# Altium project Timingcard_PROJECT.PrjPcb
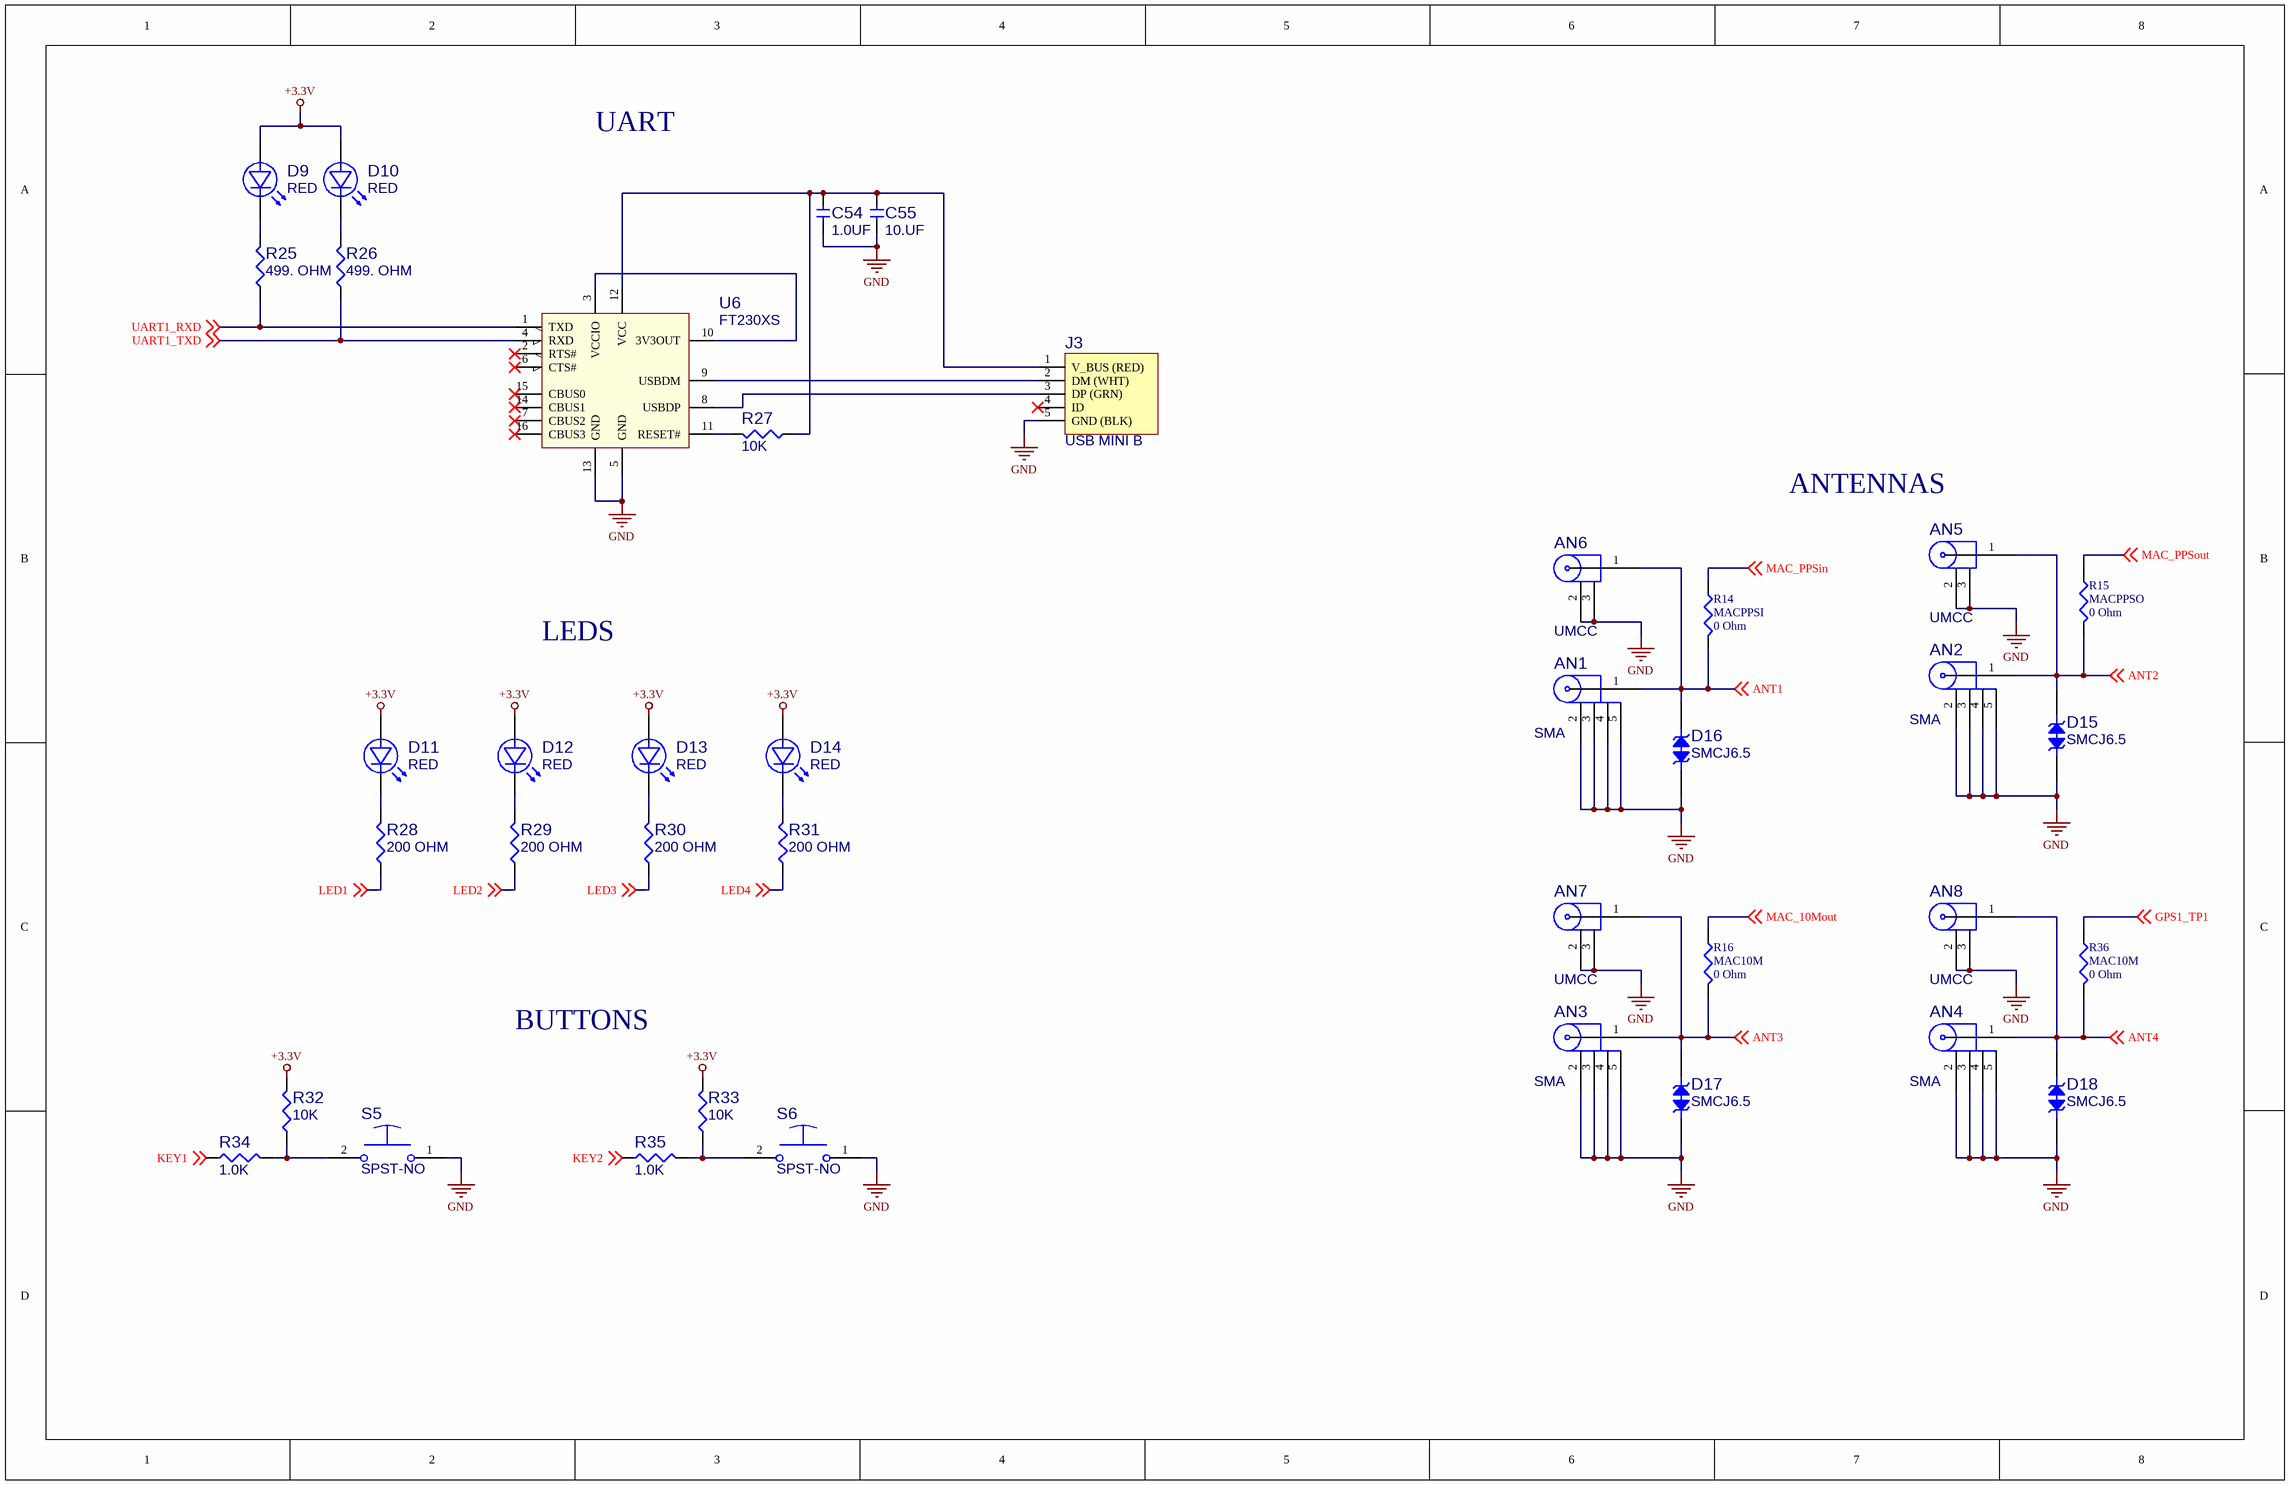
[diagram p0: UART.SchDoc]
2 sheets, 67 parts. Net scope: global (net labels, ports and power ports of the same name join across sheets).
Board file: Timingcard_PCB.PcbDoc
Sheets:
  UART.SchDoc
  MAC.SchDoc

## Sheet UART.SchDoc: Grandmaster UART, Antennas, and RTC
size Tabloid; Author: N Smith; Revision: A; SheetNumber: 3; SheetTotal: 6; Customer: 01910

### Parts
AN1  value SMA  [AMPHENOL-901-143-6RFX]  (hidden comment: RF-901-143-6FRX)
AN2  value SMA  [AMPHENOL-901-143-6RFX]  (hidden comment: RF-901-143-6FRX)
AN3  value SMA  [AMPHENOL-901-143-6RFX]  (hidden comment: RF-901-143-6FRX)
AN4  value SMA  [AMPHENOL-901-143-6RFX]  (hidden comment: RF-901-143-6FRX)
AN5  value UMCC  [U.FL UMCC JACK]  (hidden comment: 1909763-1)
AN6  value UMCC  [U.FL UMCC JACK]  (hidden comment: 1909763-1)
AN7  value UMCC  [U.FL UMCC JACK]  (hidden comment: 1909763-1)
AN8  value UMCC  [U.FL UMCC JACK]  (hidden comment: 1909763-1)
C54  value 1.0UF  [CAPC2012X14N]  (hidden comment: CAP_0805_1UF_25V)
C55  value 10.UF  [CAPC1608X10N]  (hidden comment: GRT188R61E106ME13D)
D9  RED  [DIOM1608X06N]
D10  RED  [DIOM1608X06N]
D11  RED  [DIOM1608X06N]
D12  RED  [DIOM1608X06N]
D13  RED  [DIOM1608X06N]
D14  RED  [DIOM1608X06N]
D15  value SMCJ6.5  [DIOM6959X26N]  (hidden comment: SMCJ6.5CA)
D16  value SMCJ6.5  [DIOM6959X26N]  (hidden comment: SMCJ6.5CA)
D17  value SMCJ6.5  [DIOM6959X26N]  (hidden comment: SMCJ6.5CA)
D18  value SMCJ6.5  [DIOM6959X26N]  (hidden comment: SMCJ6.5CA)
J3  value USB MINI B  [USB_1734035]  (hidden comment: USB_B_1734035)
R14  MACPPSI  value 0 Ohm  [J1-0603]
R15  MACPPSO  value 0 Ohm  [J1-0603]
R16  MAC10M  value 0 Ohm  [J1-0603]
R25  value 499. OHM  [RESC1005X04N]  (hidden comment: ERJ-2RKF4990X)
R26  value 499. OHM  [RESC1005X04N]  (hidden comment: ERJ-2RKF4990X)
R27  value 10K  [RESC1608X50N]  (hidden comment: ERJ-3EKF1002V)
R28  value 200 OHM  [RESC1608X50N]  (hidden comment: ERJ-3EKF2000V)
R29  value 200 OHM  [RESC1608X50N]  (hidden comment: ERJ-3EKF2000V)
R30  value 200 OHM  [RESC1608X50N]  (hidden comment: ERJ-3EKF2000V)
R31  value 200 OHM  [RESC1608X50N]  (hidden comment: ERJ-3EKF2000V)
R32  value 10K  [RESC1608X50N]  (hidden comment: ERJ-3EKF1002V)
R33  value 10K  [RESC1608X50N]  (hidden comment: ERJ-3EKF1002V)
R34  value 1.0K  [RESC1608X50N]  (hidden comment: ERJ-3EKF1001V)
R35  value 1.0K  [RESC1608X50N]  (hidden comment: ERJ-3EKF1001V)
R36  MAC10M  value 0 Ohm  [J1-0603]
S5  value SPST-NO  [OMRON-B3U-1000P]  (hidden comment: B3U-1000P)
S6  value SPST-NO  [OMRON-B3U-1000P]  (hidden comment: B3U-1000P)
U6  value FT230XS  [SOP64P600X170-16N]  (hidden comment: FT230XS-R)

### Nets
+3.3V: D9.2(A) D10.2(A) D11.2(A) D12.2(A) D13.2(A) D14.2(A) R32.2 R33.2
GND: AN1.2 AN1.3 AN1.4 AN1.5 AN2.2 AN2.3 AN2.4 AN2.5 AN3.2 AN3.3 AN3.4 AN3.5 AN4.2 AN4.3 AN4.4 AN4.5 AN5.2 AN5.3 AN6.2 AN6.3 AN7.2 AN7.3 AN8.2 AN8.3 C54.1 C55.1 D15.K D16.K D17.K D18.K J3.5(GND_(BLK)) S5.1 S6.1 U6.5(GND) U6.13(GND)
ANT1: AN1.1 AN6.1 D16.A R14.2 ; off-sheet ANT1
ANT2: AN2.1 AN5.1 D15.A R15.2 ; off-sheet ANT2
ANT3: AN3.1 AN7.1 D17.A R16.2 ; off-sheet ANT3
ANT4: AN4.1 AN8.1 D18.A R36.2 ; off-sheet ANT4
GPS1_TP1: R36.1 ; off-sheet GPS1_TP1
KEY1: R34.1 ; off-sheet KEY1
KEY2: R35.1 ; off-sheet KEY2
LED1: R28.1 ; off-sheet LED1
LED2: R29.1 ; off-sheet LED2
LED3: R30.1 ; off-sheet LED3
LED4: R31.1 ; off-sheet LED4
MAC_10Mout: R16.1 ; off-sheet MAC_10Mout
MAC_PPSin: R14.1 ; off-sheet MAC_PPSin
MAC_PPSout: R15.1 ; off-sheet MAC_PPSout
UART1_RXD: R25.1 U6.1(TXD) ; off-sheet UART1_RXD
UART1_TXD: R26.1 U6.4(RXD) ; off-sheet UART1_TXD
NetC54_2: C54.2 C55.2 J3.1(V_BUS_(RED)) R27.1 U6.12(VCC)
NetD9_1: D9.1(K) R25.2
NetD10_1: D10.1(K) R26.2
NetD11_1: D11.1(K) R28.2
NetD12_1: D12.1(K) R29.2
NetD13_1: D13.1(K) R30.2
NetD14_1: D14.1(K) R31.2
NetJ3_2: J3.2(DM_(WHT)) U6.9(USBDM)
NetJ3_3: J3.3(DP_(GRN)) U6.8(USBDP)
NetR27_2: R27.2 U6.11(RESET#)
NetR32_1: R32.1 R34.2 S5.2
NetR33_1: R33.1 R35.2 S6.2
NetU6_3: U6.3(VCCIO) U6.10(3V3OUT)

Not connected (* = marked no-connect by the designer): J3 4(ID)*; U6 2(RTS#)* 6(CTS#)* 7(CBUS2)* 14(CBUS1)* 15(CBUS0)* 16(CBUS3)*

### Notes on the sheet
- UART
- ANTENNAS
- LEDS
- BUTTONS

### Library data of the parts
AN1-AN4 = RF-901-143-6FRX: CONN, JACK, SMA, FEMALE, 50 OHM, R/A, GOLD, TH; MFG PART NUM: 901-143-6RFX; VALENTIUM PART NUM: <VALENTIUM>; MFG Name: AMPHENOL; MAXTEMP: 165C; MINTEMP: -65C; P2: 50 OHM; MODIFY DATE: 10/10/2013; CATEGORY: CONN, JACK; OTHER: GOLD; P1: FEMALE; P3: R/A; SIZE: 9.86MM HT; DESC: CONN, JACK, SMA, FEMALE, 50 OHM, R/A, GOLD, TH; Supplier 1: Digi-Key; Supplier Part Number 1: ARFX1232-ND
AN5-AN8 = UMCC: CONN, JACK, UMCC, MALE, 50 OHM, U.FL, GOLD, SMT; VALENTIUM PART NUM: <VALENTIUM>; MFG Name: TE; MAXTEMP: 90C; MINTEMP: -40C; P2: 50 OHM; P3: ST; MFG PART NUM: 1909763-1; MODIFY DATE: 10/10/2013; CATEGORY: CONN, JACK; OTHER: GOLD; P1: MALE; SIZE: 1.25MM HT; DESC: CONN, JACK, UMCC, MALE, 50 OHM, U.FL, GOLD, SMT; Supplier 1: Digi-Key; Supplier Part Number 1: A118077CT-ND
C54 = CAP_0805_1UF_25V: CAP, CER, 1.0UF, 25V, 10%, X5R, 0805; MFG PART NUM: 08053D105KAT2A; VALENTIUM PART NUM: <VALENTIUM>; MFG NAME: AVX; MAXTEMP: 85C; MINTEMP: -55C; MODIFY DATE: 10/23/2013; CATEGORY: CAP, CER; Date: 4/11/2006 3:37:28 PM; SHEETPART: *; P1: 10%; P2: 25V; P3: X5R; Size: 0805; Supplier 1: Digi-Key; Supplier Part Number 1: 478-1409-1-ND; DESC: CAP, CER, 1.0UF, 25V, 10%, X5R, 0805
C55 = CAP_0603_10UF_25V: CAP, CER, 10.UF, 25V, 20%, X5R, AEC-Q200, 0603; VALENTIUM PART NUM: <VALENTIUM>; MFG NAME: MURATA; MAXTEMP: 85C; MINTEMP: -55C; CATEGORY: CAP, CER; MFG PART NUM: GRT188R61E106ME13D; MODIFY DATE: 10/23/2013; Date: 7/25/2013; SHEETPART: *; P1: 20%; OTHER: AEC-Q200; P2: 25V; P3: X5R; Size: 0603; DESC: CAP, CER, 10.UF, 25V, 20%, X5R, AEC-Q200, 0603; Supplier 1: Digi-Key; Supplier Part Number 1: 490-12323-6-ND
D9-D14 = SMTLED_RED_0603_SML: LED, RED, SML-LX0603, 635NM, 2V, 20MA, 0603; MFG PART NUM: SML-LX0603IW-TR; VALENTIUM PART NUM: <VALENTIUM>; MFG NAME: LUMEX; MAXTEMP: 85C; MINTEMP: -25C; MODIFY DATE: 9/4/2013; CATEGORY: LED; OTHER: SML-LX0603; P1: 635NM; P2: 2V; P3: 20MA; SIZE: 0603; SHEETPART: *; DESC: LED, RED, SML-LX0603, 635NM, 2V, 20MA, 0603; Supplier 1: Digi-Key; Supplier Part Number 1: 67-1548-1-ND; VALUE: RED
D15-D18 = SMCJ6.5CA: DIO, TVS, SMCJ6.5, 6.5V, BIDIR, 1.5KW, SMC; VALENTIUM PART NUM: <VALENTIUM>; MFG NAME: LITTELFUSE; MAXTEMP: 150C; MINTEMP: -55C; OTHER: SMCJ; MFG PART NUM: SMCJ6.5CA; MODIFY DATE: 9/4/2013; CATEGORY: DIO, TVS; P1: 6.5V; P2: BIDIR; P3: 1.5KW; SIZE: SMC; SHEETPART: *; Supplier 1: Digi-Key; Supplier Part Number 1: SMCJ6.5CALFCT-ND; DESC: DIO, TVS, SMCJ6.5, 6.5V, BIDIR, 1.5KW, SMC
J3 = USB_B_1734035: CONN, REC, USB, R/A, MINI, TYPE B, 5 POS, SMT W/BRD GUIDE; MFG PART NUM: 1734035-2; VALENTIUM PART NUM: <VALENTIUM>; MFG NAME: TE CONNECTIVITY/AMP; MAXTEMP: C; P2: 5 POS; CATEGORY: CONN, REC; MODIFY DATE: 10/10/2013; MINTEMP: C; OTHER: USB; P1: R/A; P3: USB MINI B; SIZE: SMT; DESC: CONN, REC, USB, R/A, MINI, TYPE B, 5 POS, SMT W/BRD GUIDE; Supplier 1: Digi-Key; Supplier Part Number 1: A31727CT-ND
R14-R16 R36 = Res3: Resistor; Published: 8-Jun-2000; LatestRevisionDate: 29-May-2009; LatestRevisionNote: IPC-7351 Footprint Added.; PackageReference: J1-0603; Publisher: Altium Limited; PackageDescription: Chip Resistor
R25 R26 = RES_0402_499: RES, 499. OHM, 1%, 1/16W, TF, AEC-Q200, 0402; VELENTIUM PART NUM: <VELENTIUM>; MFG NAME: PANASONIC; MAXTEMP: 155C; MINTEMP: -55C; OTHER: 100PPM, AEC-Q200; SUB: GENERIC; ModifyDate: 7/25/2013; MFG PART NUM: ERJ-2RKF4990X; CATEGORY: RES; Date: 7/26/2013; P1: 1%; P3: TF; P2: 1/16W; SIZE: 0402; SHEETPART: *; DESC: RES, 499. OHM, 1%, 1/16W, TF, AEC-Q200, 0402; Supplier 1: Digi-Key; Supplier Part Number 1: P499LCT-ND
R27 R32 R33 = RES_0603_10K: RES, 10K, 1%, 1/10W, TF, 0603; VELENTIUM PART NUM: <VELENTIUM>; MFG NAME: PANASONIC; MAXTEMP: 125C; MINTEMP: -55C; OTHER: 100PPM; SUB: GENERIC; ModifyDate: 7/25/2013; MFG PART NUM: ERJ-3EKF1002V; CATEGORY: RES; Date: 7/26/2013; P1: 1%; P3: TF; P2: 1/10W; SIZE: 0603; Supplier 1: Digi-Key; Supplier Part Number 1: P10.0KHCT-ND; SHEETPART: *; DESC: RES, 10K, 1%, 1/10W, TF, 0603
R28-R31 = RES_0603_200: RES, 200 OHM, 1%, 1/10W, TF, 0603; VELENTIUM PART NUM: <VELENTIUM>; MFG NAME: PANASONIC; MAXTEMP: 125C; MINTEMP: -55C; OTHER: 100PPM; SUB: GENERIC; ModifyDate: 7/25/2013; MFG PART NUM: ERJ-3EKF2000V; CATEGORY: RES; Date: 7/26/2013; P1: 1%; P3: TF; P2: 1/10W; SIZE: 0603; SHEETPART: *; DESC: RES, 200 OHM, 1%, 1/10W, TF, 0603; Supplier 1: Digi-Key; Supplier Part Number 1: P200HCT-ND
R34 R35 = RES_0603_1.0K: RES, 1.0K, 1%, 1/10W, TF, 0603; VELENTIUM PART NUM: <VELENTIUM>; MFG NAME: PANASONIC; MAXTEMP: 125C; MINTEMP: -55C; OTHER: 100PPM; SUB: GENERIC; ModifyDate: 7/25/2013; MFG PART NUM: ERJ-3EKF1001V; CATEGORY: RES; Date: 7/26/2013; P1: 1%; P3: TF; P2: 1/10W; SIZE: 0603; Supplier 1: Digi-Key; Supplier Part Number 1: P1.00KHCT-ND; SHEETPART: *; DESC: RES, 1.0K, 1%, 1/10W, TF, 0603
S5 S6 = B3U-1000P: SW, SPST-NO, TACT, 12V, 50MA, 3X2.5MM SMT, B3U SERIES; VALENTIUM PART NUM: <VALENTIUM>; MFG NAME: OMRON; MAXTEMP: 70C; MINTEMP: -25C; MFG PART NUM: B3U-1000P; MODIFY DATE: 9/5/2013; CATEGORY: SW; OTHER: B3U SERIES; P1: 12V; P2: 50mA; P3: TACT; SIZE: 3X2.5MM; SHEETPART: *; DESC: SW, SPST-NO, TACT, 12V, 50MA, 3X2.5MM SMT, B3U SERIES; Supplier 1: Digi-Key; Supplier Part Number 1: SW1020CT-ND
U6 = FT230XS-R: IC, TCVR, FT230, USB TO UART, 5V, FTDI, 16SSOP; VELENTIUM PART NUM: <V PART NUM>; MAXTEMP: 85C; MINTEMP: -40C; MFG PART NUM: FT230XS-R; MFG NAME: FTDI; MODIFY DATE: 8/14/2013; CATEGORY: IC, TCVR; P1: USB TO UART; P2: 5V; P3: FTDI; SIZE: 20SSOP; SHEETPART: *; DESC: IC, TCVR, FT230, USB TO UART, 5V, FTDI, 16SSOP; Supplier 1: Digi-Key; Supplier Part Number 1: 768-1135-1-ND

## Sheet MAC.SchDoc: Grandmaster MAC & Clock Generation
size Tabloid; Author: N Smith; Revision: A; SheetNumber: 5; SheetTotal: 6; Customer: 01910
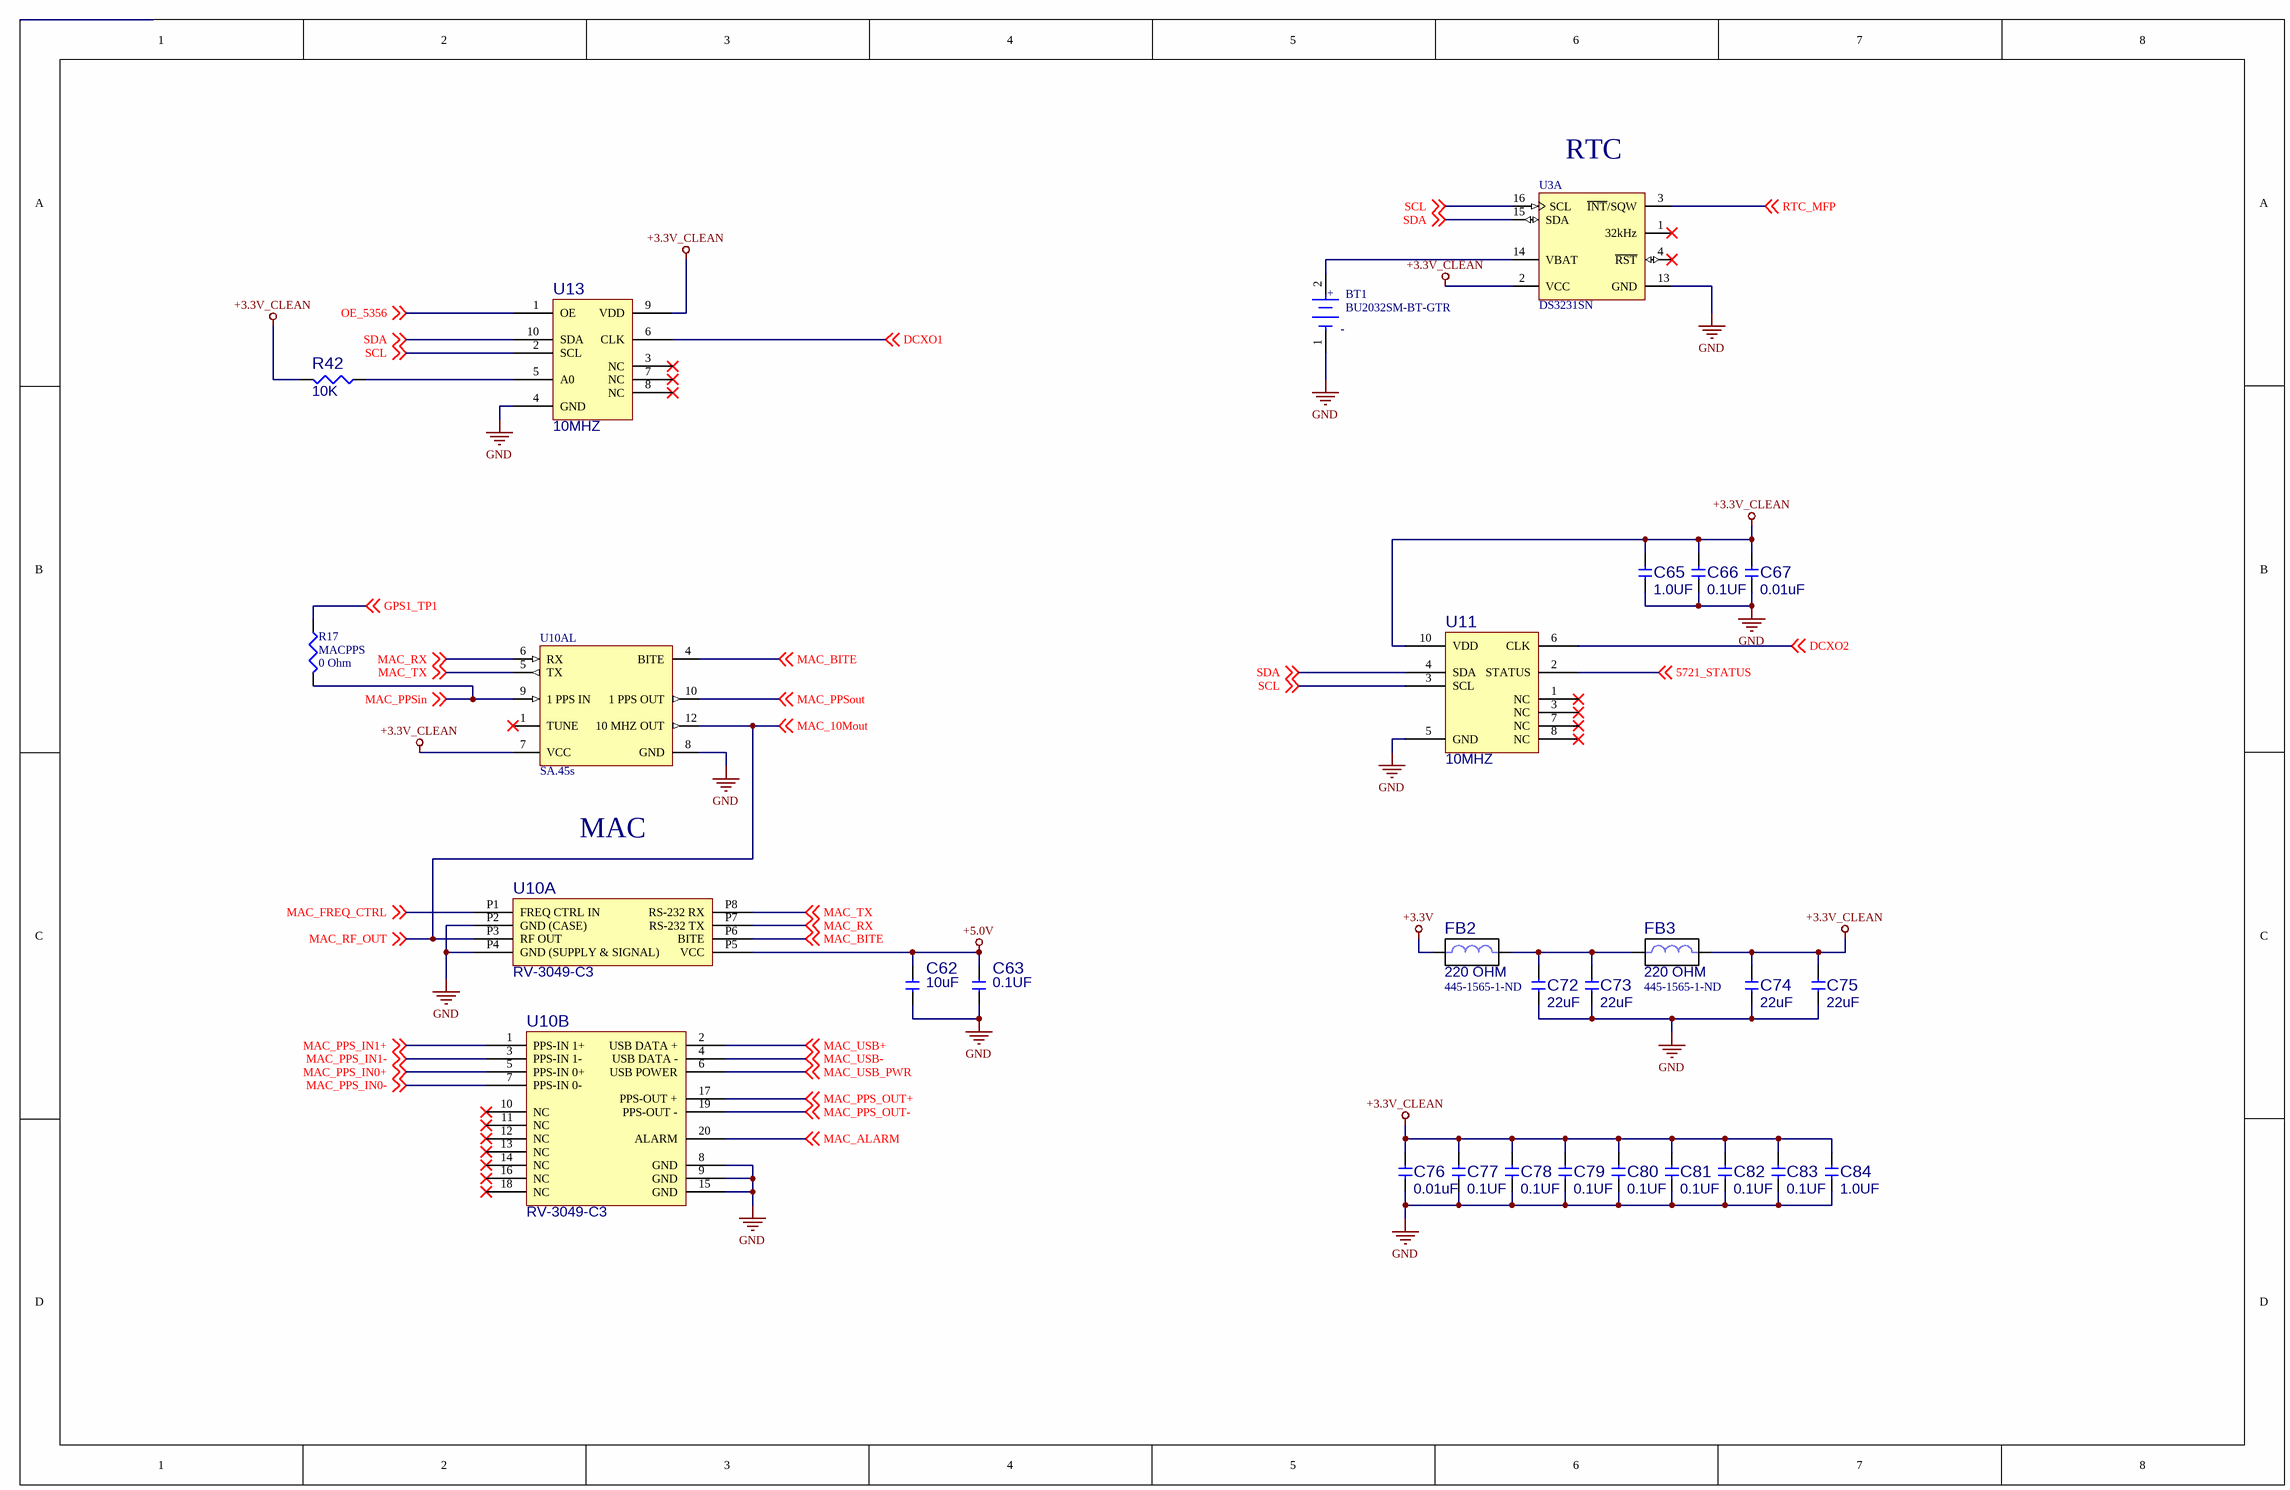
[diagram p1: MAC.SchDoc]

### Parts
BT1  BU2032SM-BT-GTR  [FP-BU2032SM-BT-GTR-MFG]
C62  value 10uF  [CAPC2012X14N]  (hidden comment: CAP_0805_10UF_25V)
C63  value 0.1UF  [CAPC1005X06N]  (hidden comment: CAP_0402_0.1UF_50V)
C65  value 1.0UF  [CAPC2012X14N]  (hidden comment: CAP_0805_1UF_50V)
C66  value 0.1UF  [CAPC1005X06N]  (hidden comment: CAP_0402_0.1UF_50V)
C67  value 0.01uF  [CAPC1608X10N]  (hidden comment: CAP_0603_0.01UF_50V)
C72  value 22uF  [CAPC2012X14N]  (hidden comment: CAP_0805_22UF_16V)
C73  value 22uF  [CAPC2012X14N]  (hidden comment: CAP_0805_22UF_16V)
C74  value 22uF  [CAPC2012X14N]  (hidden comment: CAP_0805_22UF_16V)
C75  value 22uF  [CAPC2012X14N]  (hidden comment: CAP_0805_22UF_16V)
C76  value 0.01uF  [CAPC1608X10N]  (hidden comment: CAP_0603_0.01UF_50V)
C77  value 0.1UF  [CAPC1005X06N]  (hidden comment: CAP_0402_0.1UF_50V)
C78  value 0.1UF  [CAPC1005X06N]  (hidden comment: CAP_0402_0.1UF_50V)
C79  value 0.1UF  [CAPC1005X06N]  (hidden comment: CAP_0402_0.1UF_50V)
C80  value 0.1UF  [CAPC1005X06N]  (hidden comment: CAP_0402_0.1UF_50V)
C81  value 0.1UF  [CAPC1005X06N]  (hidden comment: CAP_0402_0.1UF_50V)
C82  value 0.1UF  [CAPC1005X06N]  (hidden comment: CAP_0402_0.1UF_50V)
C83  value 0.1UF  [CAPC1005X06N]  (hidden comment: CAP_0402_0.1UF_50V)
C84  value 1.0UF  [CAPC2012X14N]  (hidden comment: CAP_0805_1UF_50V)
FB2  value 220 OHM  Supplier Part Number 1: 445-1565-1-ND  [INDC1608X09N]  (hidden comment: MPZ1608_220OHM_0603)
FB3  value 220 OHM  Supplier Part Number 1: 445-1565-1-ND  [INDC1608X09N]  (hidden comment: MPZ1608_220OHM_0603)
R17  MACPPS  value 0 Ohm  [J1-0603]
R42  value 10K  [RESC1608X50N]  (hidden comment: ERJ-3EKF1002V)
U3  DS3231SN  [W16-H2_L]  (part A of 2)
U10  value RV-3049-C3  [MAC-SA5X]  (hidden comment: MAC-SA5X)  (parts A,B of 2)
U10AL  SA.45s  [MCSM-090-02984-00X]
U11  value 10MHZ  [SIT5721]  (hidden comment: SiT5721AI-KWA33-T-10.000000)
U13  value 10MHZ  [SIT5155]  (hidden comment: SiT5356AI-FQA33-IT-10.000000)

### Nets
+3.3V: FB2.1
+3.3V_CLEAN: C65.2 C66.2 C67.2 C74.2 C75.2 C76.2 C77.2 C78.2 C79.2 C80.2 C81.2 C82.2 C83.2 C84.2 FB3.2 R42.2 U3.2(VCC) U10AL.7(VCC) U11.10(VDD) U13.9(VDD)
+5.0V: C62.1 C63.1 U10.P5(VCC)
GND: BT1.1(C) C62.2 C63.2 C65.1 C66.1 C67.1 C72.1 C73.1 C74.1 C75.1 C76.1 C77.1 C78.1 C79.1 C80.1 C81.1 C82.1 C83.1 C84.1 U3.13(GND) U10.8(GND) U10.9(GND) U10.15(GND) U10.P2(GND_(CASE)) U10.P4(GND_(SUPPLY_&_SIGNAL)) U10AL.8(GND) U11.5(GND) U13.4(GND)
5721_STATUS: U11.2(STATUS) ; off-sheet 5721_STATUS
DCXO1: U13.6(CLK) ; off-sheet DCXO1
DCXO2: U11.6(CLK) ; off-sheet DCXO2
GPS1_TP1: R17.1 ; off-sheet GPS1_TP1
MAC_10Mout: U10.P3(RF_OUT) U10AL.12(10_MHZ_OUT) ; off-sheet MAC_RF_OUT, off-sheet MAC_10Mout  [also labelled MAC_RF_OUT]
MAC_ALARM: U10.20(ALARM) ; off-sheet MAC_ALARM
MAC_BITE: U10.P6(BITE) U10AL.4(BITE) ; off-sheet MAC_BITE
MAC_FREQ_CTRL: U10.P1(FREQ_CTRL_IN) ; off-sheet MAC_FREQ_CTRL
MAC_PPS_IN0+: U10.5(PPS-IN_0+) ; off-sheet MAC_PPS_IN0+
MAC_PPS_IN0-: U10.7(PPS-IN_0-) ; off-sheet MAC_PPS_IN0-
MAC_PPS_IN1+: U10.1(PPS-IN_1+) ; off-sheet MAC_PPS_IN1+
MAC_PPS_IN1-: U10.3(PPS-IN_1-) ; off-sheet MAC_PPS_IN1-
MAC_PPS_OUT+: U10.17(PPS-OUT_+) ; off-sheet MAC_PPS_OUT+
MAC_PPS_OUT-: U10.19(PPS-OUT_-) ; off-sheet MAC_PPS_OUT-
MAC_PPSin: R17.2 U10AL.9(1_PPS_IN) ; off-sheet MAC_PPSin
MAC_PPSout: U10AL.10(1_PPS_OUT) ; off-sheet MAC_PPSout
MAC_RX: U10.P7(RS-232_TX) U10AL.6(RX) ; off-sheet MAC_RX
MAC_TX: U10.P8(RS-232_RX) U10AL.5(TX) ; off-sheet MAC_TX
MAC_USB+: U10.2(USB_DATA_+) ; off-sheet MAC_USB+
MAC_USB-: U10.4(USB_DATA_-) ; off-sheet MAC_USB-
MAC_USB_PWR: U10.6(USB_POWER) ; off-sheet MAC_USB_PWR
OE_5356: U13.1(OE) ; off-sheet OE_5356
RTC_MFP: U3.3(~{INT}/SQW) ; off-sheet RTC_MFP
SCL: U3.16(SCL) U11.3(SCL) U13.2(SCL) ; off-sheet SCL
SDA: U3.15(SDA) U11.4(SDA) U13.10(SDA) ; off-sheet SDA
NetBT1_2: BT1.2(A) U3.14(VBAT)
NetC72_2: C72.2 C73.2 FB2.2 FB3.1
NetR42_1: R42.1 U13.5(A0)

Not connected (* = marked no-connect by the designer): U3 1(32kHz)* 4(~{RST})*; U10 10(NC)* 11(NC)* 12(NC)* 13(NC)* 14(NC)* 16(NC)* 18(NC)*; U10AL 1(TUNE)*; U11 1(NC)* 7(NC)* 8(NC)*; U13 3(NC)* 7(NC)* 8(NC)*

### Notes on the sheet
- (near U3) RTC
- MAC
- (in symbol CMP-136216-000002-1) +; -

### Library data of the parts
BT1 = CMP-136216-000002-1: BATTERY HOLDER COIN 20MM SMD; Number of Cells: 1; Termination: SMD/SMT; Mount: Surface Mount; Max Operating Temperature: 280°C; Min Operating Temperature: -40°C; Package Quantity: 400; Case/Package: SMD/SMT
C62 = CAP_0805_10UF_25V: CAP, CER, 10.UF, 25V, 10%, X5R, 0805; MFG PART NUM: TMK212BBJ106KG-T; VALENTIUM PART NUM: <VALENTIUM>; MFG NAME: TAIYO YUDEN; MAXTEMP: 85C; MINTEMP: -55C; DESC: CAP, CER, 10.UF, 10V, 10%, X5R, 0805; MODIFY DATE: 10/23/2013; CATEGORY: CAP, CER; Date: 4/11/2006 3:37:28 PM; SHEETPART: *; P1: 10%; P2: 25V; P3: X5R; Size: 0805; Supplier 1: MOUSER; Supplier Part Number 1: 963-TMK212BBJ106KG-T
C63 C66 C77-C83 = CAP_0402_0.1UF_50V: CAP, CER, 0.1UF, 50V, 10%, X7R, AEC-Q200, 0402; MFG PART NUM: CGA2B3X7R1H104K050BB; VALENTIUM PART NUM: <VALENTIUM>; MFG NAME: TDK; MAXTEMP: 125C; MINTEMP: -55C; CATEGORY: CAP, CER; MODIFY DATE: 10/23/2013; SHEETPART: *; P1: 10%; OTHER: AEC-Q200; P2: 50V; P3: X7R; Size: 0402; DESC: CAP, CER, 0.1UF, 50V, 10%, X7R, AEC-Q200, 0402; Supplier 1: Digi-Key; Supplier Part Number 1: 445-6899-1-ND
C65 C84 = CAP_0805_1UF_50V: CAP, CER, 1.0UF, 50V, 10%, X7R, 0805; MFG PART NUM: GCM21BR71H105KA03L; VALENTIUM PART NUM: <VALENTIUM>; MFG NAME: MURATA; MAXTEMP: 125C; MINTEMP: -55C; OTHER: AEC-Q200; MODIFY DATE: 10/23/2013; CATEGORY: CAP, CER; Date: 10/31/2006 2:46:38 PM; SHEETPART: *; P1: 10%; P2: 50V; P3: X7R; Size: 0805; DESC: CAP, CER, 1.0UF, 50V, 10%, X7R, 0805; Supplier 1: Digi-Key; Supplier Part Number 1: 490-10675-1-ND
C67 C76 = CAP_0603_0.01UF_50V: CAP, CER, 0.01UF, 50V, 10%, X7R, 0603; MFG PART NUM: C0603C103K5RACTU; VALENTIUM PART NUM: <VALENTIUM>; MFG NAME: KEMET; MAXTEMP: 125C; MINTEMP: -55C; CATEGORY: CAP, CER; MODIFY DATE: 10/23/2013; Date: 7/24/2013; SHEETPART: *; P1: 10%; P2: 50V; P3: X7R; Size: 0603; Supplier 1: Digi-Key; Supplier Part Number 1: 399-1091-1-ND; DESC: CAP, CER, 0.01UF, 50V, 10%, X7R, 0603
C72-C75 = CAP_0805_22UF_16V: CAP, CER, 22.UF, 16V, 20%, X5R, 0805; MFG PART NUM: GRM219R61C226ME15L; VALENTIUM PART NUM: <VALENTIUM>; MFG NAME: MURATA; MAXTEMP: 85C; MINTEMP: -55C; MODIFY DATE: 10/23/2013; CATEGORY: CAP, CER; Date: 4/11/2006 3:37:28 PM; SHEETPART: *; P1: 20%; P2: 16V; P3: X5R; Size: 0805; DESC: CAP, CER, 22.UF, 16V, 20%, X5R, 0805; Supplier 1: Digi-Key; Supplier Part Number 1: 490-9952-1-ND
FB2 FB3 = MPZ1608_220OHM_0603: FER, 220 OHM, 100MHZ, 2.2A, 0.05OHM DC, MPZ1608, 0603; MFG PART NUM: MPZ1608S221ATA00; VALENTIUM PART NUM: <VALENTIUM>; MFG NAME: TDK CORP; MAXTEMP: 125C; MINTEMP: -55C; MODIFY DATE: 9/4/2013; CATEGORY: FERRITE; Date: 8/6/2013; P1: 100MHZ; P2: 2.2A; P3: 0.05 OHM; SIZE: 0603; SHEETPART: *; DESC: FER, 220 OHM, 100MHZ, 2.2A, 0.05OHM DC, MPZ1608, 0603; OTHER: MPZ1608; Supplier 1: Digi-Key
R17 = Res3: Resistor; Published: 8-Jun-2000; LatestRevisionDate: 29-May-2009; LatestRevisionNote: IPC-7351 Footprint Added.; PackageReference: J1-0603; Publisher: Altium Limited; PackageDescription: Chip Resistor
R42 = RES_0603_10K: as R27 on sheet UART; ModifyDate: 7/25/2013; MFG PART NUM: ERJ-3EKF1002V; CATEGORY: RES; Date: 7/26/2013; P1: 1%; P3: TF; P2: 1/10W; SIZE: 0603; Supplier 1: Digi-Key; Supplier Part Number 1: P10.0KHCT-ND; SHEETPART: *; DESC: RES, 10K, 1%, 1/10W, TF, 0603
U3 = CMP-0254-00293-1: Extremely Accurate I2C-Integrated Real-Time Clock/TCXO/Crystal, 16-Pin SO, -40 to 85 degC; ComponentLink1Description: Manufacturer URL; ComponentLink3URL: http://pdfserv.maxim-ic.com/package_dwgs/21-0042.PDF; ComponentLink3Description: Package Specification; PackageVersion: revD, 2010; ComponentLink2URL: http://datasheets.maxim-ic.com/en/ds/DS3231.pdf; ComponentLink2Description: Datasheet; PackageReference: W16-H2; Code_JEDEC: MS-013-AA; ComponentLink1URL: http://www.maxim-ic.com; PackageDescription: 16-Pin Small-Outline IC, Wide (0.3in), 1.27 mm Pitch, SOIC (W); Code_IPC: SOIC127P1030-16; DatasheetVersion: Rev 8, Jul-2010
U10 = MAC-SA5X: MOD, MAC, MAC-SA5X, ATOMIC CLOCK; VELENTIUM PART NUM: <V PART NUM>; MFG NAME: MICROCHIP; MAXTEMP: 85C; MINTEMP: -40C; OTHER: AEC-Q200; MODIFY DATE: 3/22/2006 1:36:44 PM; MFG PART NUM: MAC-SA5X; CATEGORY: MOD; P1: ATOMIC CLOCK; SHEETPART: *; DESC: MOD, MAC, MAC-SA5X, ATOMIC CLOCK
U10AL = CMP-2000-07612-1: Quantum(TM) Miniature Chip Scale Atomic Clock, 3.3 V, 10 MHz, -10 to 70 degC, 9-Pin THD, RoHS, Bulk; Manufacturer: Microsemi; Package Description: 9-Pin Through Hole Device, Body 40.64 x 35.306 mm; Manufacturer URL: http://www.microsemi.com/; Datasheet Version: 03/2017; Package Reference: 090-02984-00X; Datasheet URL: https://media.digikey.com/pdf/Data%20Sheets/Microsemi%20PDFs/090-02984-001.pdf; Mounting Technology: ThroughHole
U11 = SiT5721AI-KWA33-T-10.000000: OSC, 10MHZ, 3.3V, 5PPB, DCOCXO, SMT; VELENTIUM PART NUM: <V PART NUM>; MFG NAME: SITIME; MAXTEMP: 85C; MINTEMP: -30C; MFG PART NUM: SiT5721AI-KWA33-T-10.000000; MODIFY DATE: 9/18/2013; CATEGORY: OSC; Date: 9/18/2013; P1: OSC; P2: 3.3V; P3: 5PPB; SIZE: 9.0X7.0MM; SHEETPART: *; DESC: OSC, 10MHZ, 3.3V, 5PPB, DCOCXO, SMT
U13 = SiT5356AI-FQA33-IT-10.000000: OSC, 10MHZ, 3.3V, 100PPB, DCTCXO, SMT; VELENTIUM PART NUM: <V PART NUM>; MFG NAME: SITIME; MAXTEMP: 85C; MINTEMP: -30C; MFG PART NUM: SiT5356AI-FQA33-IT-10.000000; MODIFY DATE: 9/18/2013; CATEGORY: OSC; Date: 9/18/2013; P1: OSC; P2: 3.3V; P3: 100PPB; SIZE: 5.0X3.2MM; SHEETPART: *; DESC: OSC, 10MHZ, 3.3V, 100PPB, DCTCXO, SMT

## Nets that join several sheets
+3.3V: UART (8 pins), MAC (FB2.1)
GND: UART (35 pins), MAC (28 pins)
GPS1_TP1: UART (R36.1), MAC (R17.1)
MAC_10Mout: UART (R16.1), MAC (U10.P3 U10AL.12)
MAC_PPSin: UART (R14.1), MAC (R17.2 U10AL.9)
MAC_PPSout: UART (R15.1), MAC (U10AL.10)